# EAGLE design SOT23-8-normal (EAGLE 6.5.0)
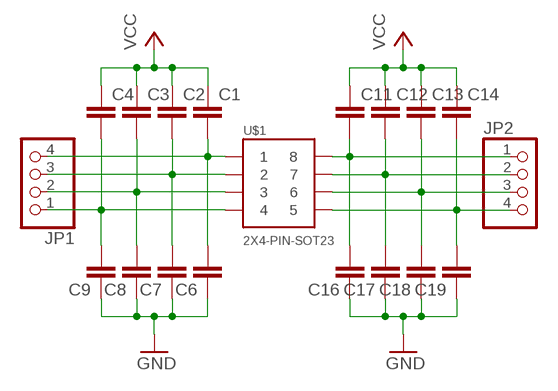
[diagram p0: schematic, sheet 1]

## Parts
C1  C-EUC0603  [C0603]
C2  C-EUC0603  [C0603]
C3  C-EUC0603  [C0603]
C4  C-EUC0603  [C0603]
C6  C-EUC0805  [C0805]
C7  C-EUC0805  [C0805]
C8  C-EUC0805  [C0805]
C9  C-EUC0805  [C0805]
C11  C-EUC0603  [C0603]
C12  C-EUC0603  [C0603]
C13  C-EUC0603  [C0603]
C14  C-EUC0603  [C0603]
C16  C-EUC0805  [C0805]
C17  C-EUC0805  [C0805]
C18  C-EUC0805  [C0805]
C19  C-EUC0805  [C0805]
JP1  PINHD-1X4  [1X04]
JP2  PINHD-1X4  [1X04]
U$1  2X4-PIN-SOT23  [SOT23-8]

## Nets
1: C1.2 C6.2 JP1.4 U$1.P$1
2: C2.2 C7.2 JP1.3 U$1.P$2
3: C3.2 C8.2 JP1.2 U$1.P$3
4: C4.2 C9.2 JP1.1 U$1.P$4
5: C14.2 C19.2 JP2.4 U$1.P$5
6: C13.2 C18.2 JP2.3 U$1.P$6
7: C12.2 C17.2 JP2.2 U$1.P$7
8: C11.2 C16.2 JP2.1 U$1.P$8
GND: C6.1 C7.1 C8.1 C9.1 C16.1 C17.1 C18.1 C19.1
VCC: C1.1 C2.1 C3.1 C4.1 C11.1 C12.1 C13.1 C14.1

## Library data of the parts
C1-C4 C6-C9 C11-C14 C16-C19 = p.peter-rcl:C-EU: CAPACITOR, European symbol
JP1 JP2 = pinhead:PINHD-1X4: PIN HEADER
U$1 = p.peter-pacakages:2X4-PIN

## Board
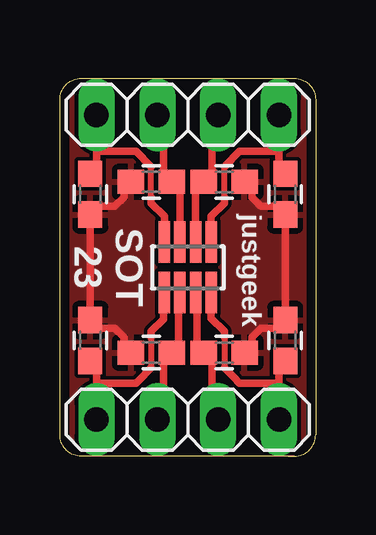
[diagram p1: board, top side]
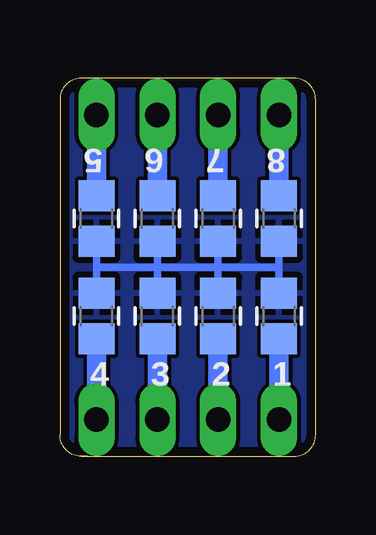
[diagram p2: board, bottom side, seen from below]

Size 10.67 x 15.75 mm. Coordinates in mm from the lower left corner, seen from the top.
Outline: 0,0.89 0,1.02
Outline: 0,1.02 0,14.86 arc-90 0.89,15.75
Outline: 0.89,15.75 1.02,15.75
Outline: 1.02,15.75 9.78,15.75 arc-90 10.67,14.86 10.67,0.89 arc-90 9.78,0
Outline: 9.78,0 9.53,0
Outline: 9.53,0 1.14,0
Outline: 1.14,0 0.89,0
Outline: 0.89,15.75 1.02,15.75
Outline: 9.53,0 9.78,0
Outline: 1.14,0 0.89,0
Outline: 0.89,0 arc-90 0,0.89
Outline: 0,0.89 0,1.02
Copper layers (1*16): Top 0.0356mm / dielectric 1.5011mm / Bottom 0.0356mm
Design rules "oshpark": minimum track width 6mil, minimum drill 13mil, track to track 6mil, track to pad 6mil, pad to pad 6mil, via to via 6mil, smd to smd 6mil, copper to edge 15mil, drill to drill 6mil, minimum pad ring 7mil, minimum via ring 7mil, stop-mask expansion 4mil, vias tented up to drill 4.1mm, thermal gap 10mil

### Footprints (pad centres in the part's own frame; a part is rotated, then mirrored left to right if it is on the bottom)
C0603 = smd 1.1 x 1: 1 -0.85,0; 2 0.85,0
C0805 = smd 1.3 x 1.5: 1 -0.95,0; 2 0.95,0
1X04 = drill 1.016 long: 1 -3.81,0; 2 -1.27,0; 3 1.27,0; 4 3.81,0
SOT23-8 = smd 0.48 x 1.725: P$1 -0.975,-1.05; P$2 -0.325,-1.05; P$3 0.325,-1.05; P$4 0.975,-1.05; P$5 0.975,1.05; P$6 0.325,1.05; P$7 -0.325,1.05; P$8 -0.975,1.05

### Placement (x,y rotation side)
C1  1.27,4.83 270 top
C2  3.81,4.32 0 top
C3  6.86,4.32 180 top
C4  9.4,4.83 270 top
C6  1.52,5.84 270 bottom
C7  4.06,5.84 270 bottom
C8  6.6,5.84 270 bottom
C9  9.14,5.84 270 bottom
C11  1.27,10.92 90 top
C12  3.81,11.43 0 top
C13  6.86,11.43 180 top
C14  9.4,10.92 90 top
C16  1.52,9.91 90 bottom
C17  4.06,9.91 90 bottom
C18  6.6,9.91 90 bottom
C19  9.14,9.91 90 bottom
JP1  5.33,1.52 180 top
JP2  5.33,14.22 0 top
U$1  5.33,7.87 0 top

### Tracks (layer width: path | path; a pad name or v marks a point on that pad's centre or on a via)
1
  Top 0.254: 3.81,4.95 3.81,3.68
  Top 0.305: JP1.4 1.52,2.16 1.52,3.05 | 1.52,3.05 1.52,3.81 1.52,3.94 1.49,3.98 C1.2 | 3.81,4.95 3.81,5.21 4.32,5.71 4.32,6.78 U$1.P$1 | 3.81,3.68 3.3,3.17 3.17,3.05 1.52,3.05
  Bottom 0.813: C6.2 JP1.4
2
  Top 0.305: JP1.3 4.06,2.41 4.32,2.67 4.32,4.32 C2.2 4.7,4.36 4.87,4.36 4.95,4.45 4.95,6.77 U$1.P$2
  Bottom 0.813: C7.2 JP1.3
3
  Top 0.305: JP1.2 6.6,2.41 6.35,2.67 6.35,4.32 C3.2 5.97,4.36 5.8,4.36 5.72,4.45 5.72,6.77 U$1.P$3
  Bottom 0.813: C8.2 JP1.2
4
  Top 0.254: 6.86,4.95 6.86,3.68
  Top 0.305: 6.86,4.95 6.86,5.21 6.31,5.76 U$1.P$4 | 6.86,3.68 7.24,3.3 7.49,3.05 9.14,3.05 | 9.14,3.05 9.14,3.3 9.14,3.72 C4.2 | 9.14,3.05 JP1.1
  Bottom 0.813: C9.2 JP1.1
5
  Top 0.254: 6.86,10.79 6.86,12.06
  Top 0.305: C14.2 9.4,11.81 9.14,12.06 9.14,12.7 | 9.14,12.7 JP2.4 | 6.86,10.79 6.86,10.54 6.31,9.99 U$1.P$5 | 6.86,12.06 7.49,12.7 9.14,12.7
  Bottom 0.813: C19.2 JP2.4
6
  Top 0.305: 5.97,11.39 C13.2 | C13.2 6.22,11.43 6.35,11.56 6.35,12.95 6.6,13.21 JP2.3 | U$1.P$6 5.66,11.08 C13.2
  Bottom 0.813: C18.2 JP2.3
7
  Top 0.305: 4.7,11.39 C12.2 | C12.2 4.57,11.43 4.32,11.68 4.32,12.95 4.06,13.21 JP2.2 | U$1.P$7 5.01,11.08 C12.2
  Bottom 0.813: C17.2 JP2.2
8
  Top 0.254: 3.81,10.79 3.81,12.06
  Top 0.305: 3.81,10.79 3.81,10.54 4.36,9.99 U$1.P$8 | 3.81,12.06 3.17,12.7 1.52,12.7 | 1.52,12.7 1.52,14.1 JP2.1 | C11.2 1.49,11.77 1.52,11.81 1.52,12.7
  Bottom 0.813: C16.2 JP2.1
GND
  Bottom 0.305: C16.1 1.52,7.87 | 1.52,7.87 4.06,7.87 | 4.06,7.87 6.6,7.87 | 6.6,7.87 9.14,7.87 | 9.14,7.87 C9.1 | C19.1 9.14,7.87 | C8.1 6.6,7.87 | C18.1 6.6,7.87 | C17.1 4.06,7.87 | C7.1 4.06,7.87 | C6.1 1.52,7.87
  pour Bottom (isolate 0.152): 0,-1.27 10.67,-1.27 10.67,17.02 0,17.02
VCC
  Top 0.305: C2.1 2.92,4.32 2.67,4.57 2.67,4.95 2.29,5.33 2.16,5.33 1.61,5.33 C1.1 1.27,7.62 1.27,7.87 1.27,8.13 C11.1 1.27,10.41 2.29,10.41 2.67,10.79 2.67,11.18 2.67,11.43 C12.1 | C3.1 8,4.32 8,4.95 8.38,5.33 9.4,5.33 C4.1 9.4,7.87 C14.1 9.4,10.41 8.38,10.41 8,10.79 8,11.43 C13.1
  pour Top (isolate 0.152): 0,0 10.67,0 10.67,15.75 0,15.75

### Text on the board
tPlace: SOT / 23 | justgeek
bPlace: 8 | 7 | 6 | 5 | 1 | 2 | 3 | 4